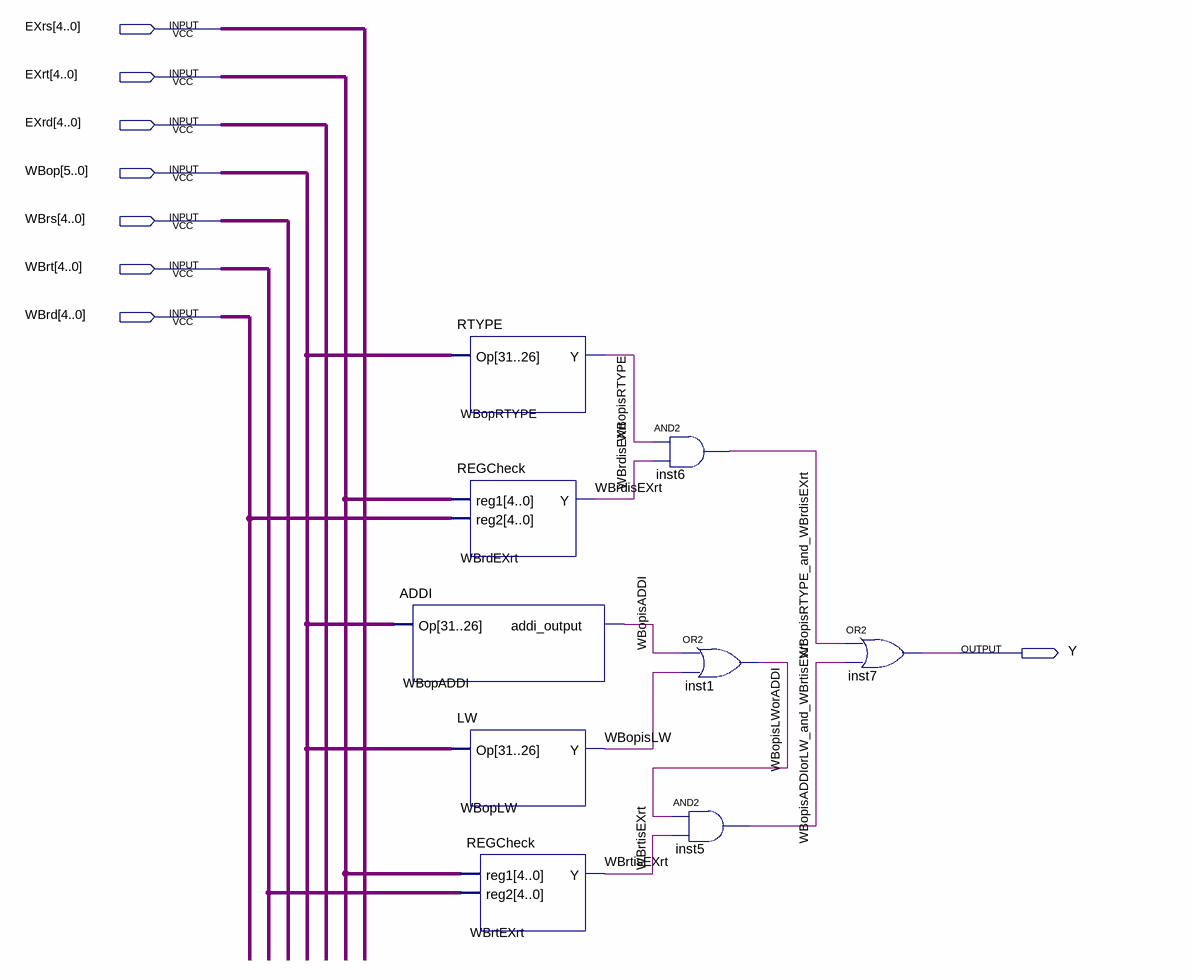
[diagram p0: schematic sheet]
// Quartus schematic ForwardBfromWBtoEX.bdf as structural Verilog: 9 symbols, 8 pins
module ForwardBfromWBtoEX (
  input  [4:0] EXrs,
  input  [4:0] EXrt,
  input  [4:0] EXrd,
  input  [5:0] WBop,
  input  [4:0] WBrs,
  input  [4:0] WBrt,
  input  [4:0] WBrd,
  output Y
);

  wire WBopisADDI, WBopisADDIorLW_and_WBrtisEXrt, WBopisLW, WBopisLWorADDI, WBopisRTYPE,
       WBopisRTYPE_and_WBrdisEXrt, WBrdisEXrt, WBrtisEXrt;

  ADDI WBopADDI (.Op(WBop), .addi_output(WBopisADDI));
  RTYPE WBopRTYPE (.Op(WBop), .Y(WBopisRTYPE));
  REGCheck WBrdEXrt (.reg1(EXrt), .reg2(WBrd), .Y(WBrdisEXrt));
  LW WBopLW (.Op(WBop), .Y(WBopisLW));
  REGCheck WBrtEXrt (.reg1(EXrt), .reg2(WBrt), .Y(WBrtisEXrt));
  and inst6 (WBopisRTYPE_and_WBrdisEXrt, WBopisRTYPE, WBrdisEXrt);
  and inst5 (WBopisADDIorLW_and_WBrtisEXrt, WBopisLWorADDI, WBrtisEXrt);
  or inst1 (WBopisLWorADDI, WBopisADDI, WBopisLW);
  or inst7 (Y, WBopisRTYPE_and_WBrdisEXrt, WBopisADDIorLW_and_WBrtisEXrt);
endmodule
